# Altium schematic sheet Sensing.SchDoc
size A3; SheetNumber: 3; SheetTotal: 11
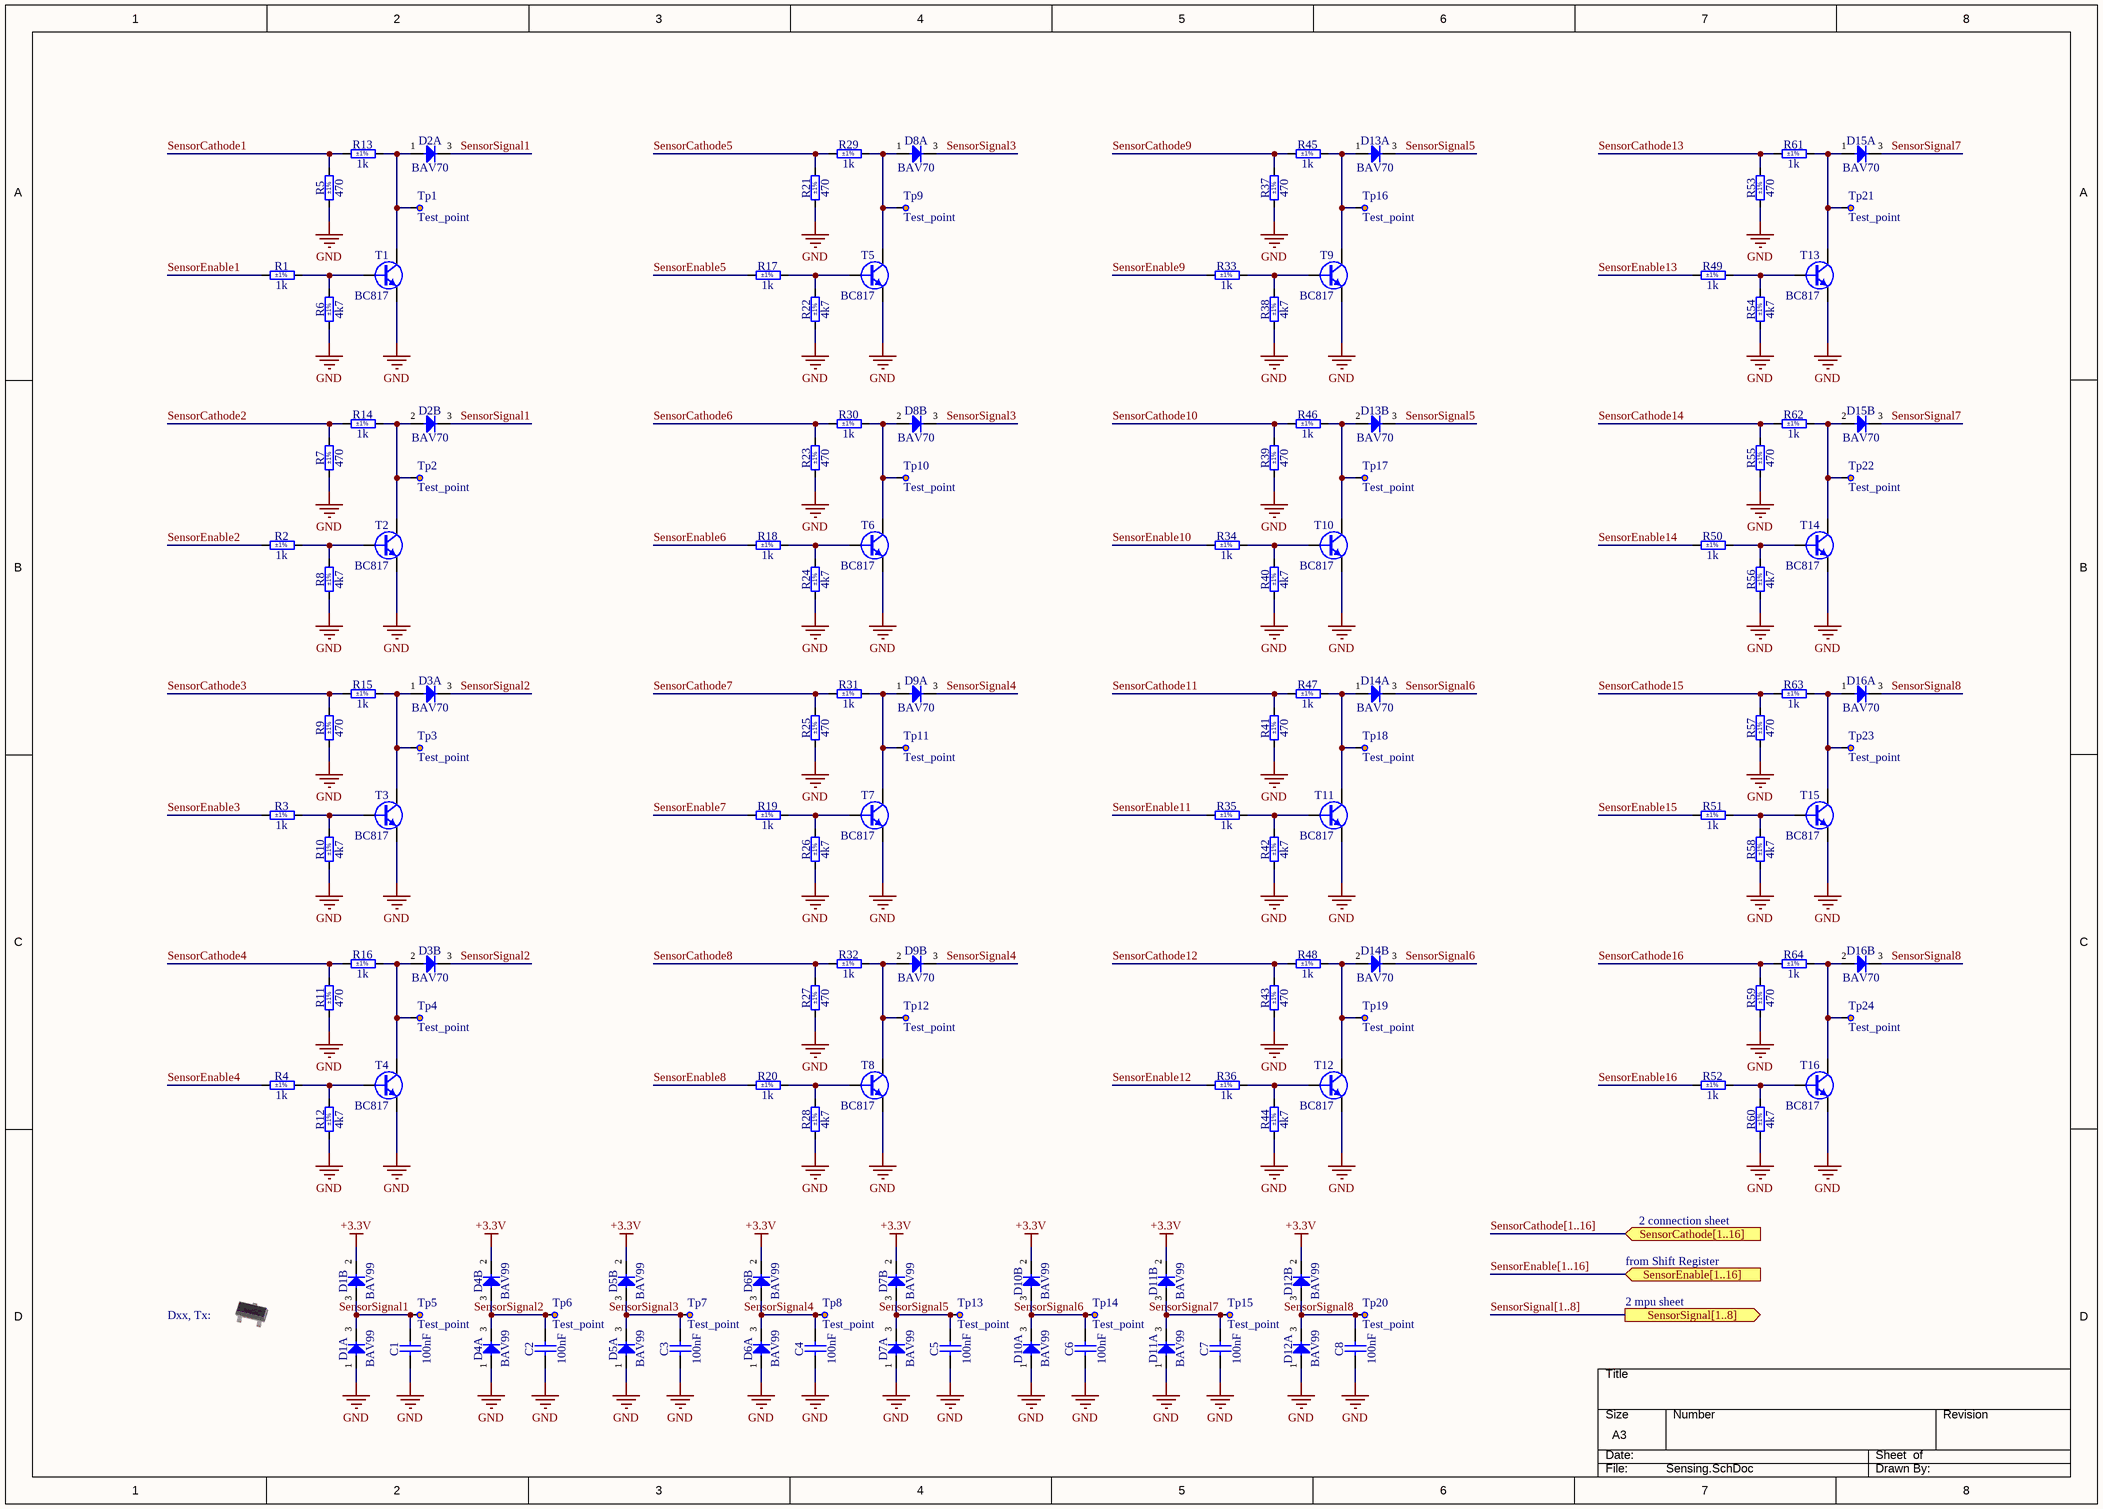
[diagram p0: Sensing.SchDoc]

## Parts
C1  100nF  [CAPC1608X87N]
C2  100nF  [CAPC1608X87N]
C3  100nF  [CAPC1608X87N]
C4  100nF  [CAPC1608X87N]
C5  100nF  [CAPC1608X87N]
C6  100nF  [CAPC1608X87N]
C7  100nF  [CAPC1608X87N]
C8  100nF  [CAPC1608X87N]
D1  BAV99  [SOT95P240X110-3N]  (parts A,B of 2)
D2  BAV70  [SOT95P240X110-3N]  (parts A,B of 2)
D3  BAV70  [SOT95P240X110-3N]  (parts A,B of 2)
D4  BAV99  [SOT95P240X110-3N]  (parts A,B of 2)
D5  BAV99  [SOT95P240X110-3N]  (parts A,B of 2)
D6  BAV99  [SOT95P240X110-3N]  (parts A,B of 2)
D7  BAV99  [SOT95P240X110-3N]  (parts A,B of 2)
D8  BAV70  [SOT95P240X110-3N]  (parts A,B of 2)
D9  BAV70  [SOT95P240X110-3N]  (parts A,B of 2)
D10  BAV99  [SOT95P240X110-3N]  (parts A,B of 2)
D11  BAV99  [SOT95P240X110-3N]  (parts A,B of 2)
D12  BAV99  [SOT95P240X110-3N]  (parts A,B of 2)
D13  BAV70  [SOT95P240X110-3N]  (parts A,B of 2)
D14  BAV70  [SOT95P240X110-3N]  (parts A,B of 2)
D15  BAV70  [SOT95P240X110-3N]  (parts A,B of 2)
D16  BAV70  [SOT95P240X110-3N]  (parts A,B of 2)
R1  1k  Tolerance: ±1%  [RESC1608X55N]
R2  1k  Tolerance: ±1%  [RESC1608X55N]
R3  1k  Tolerance: ±1%  [RESC1608X55N]
R4  1k  Tolerance: ±1%  [RESC1608X55N]
R5  470  Tolerance: ±1%  [RESC6331X70N]
R6  4k7  Tolerance: ±1%  [RESC1608X55N]
R7  470  Tolerance: ±1%  [RESC6331X70N]
R8  4k7  Tolerance: ±1%  [RESC1608X55N]
R9  470  Tolerance: ±1%  [RESC6331X70N]
R10  4k7  Tolerance: ±1%  [RESC1608X55N]
R11  470  Tolerance: ±1%  [RESC6331X70N]
R12  4k7  Tolerance: ±1%  [RESC1608X55N]
R13  1k  Tolerance: ±1%  [RESC1608X55N]
R14  1k  Tolerance: ±1%  [RESC1608X55N]
R15  1k  Tolerance: ±1%  [RESC1608X55N]
R16  1k  Tolerance: ±1%  [RESC1608X55N]
R17  1k  Tolerance: ±1%  [RESC1608X55N]
R18  1k  Tolerance: ±1%  [RESC1608X55N]
R19  1k  Tolerance: ±1%  [RESC1608X55N]
R20  1k  Tolerance: ±1%  [RESC1608X55N]
R21  470  Tolerance: ±1%  [RESC6331X70N]
R22  4k7  Tolerance: ±1%  [RESC1608X55N]
R23  470  Tolerance: ±1%  [RESC6331X70N]
R24  4k7  Tolerance: ±1%  [RESC1608X55N]
R25  470  Tolerance: ±1%  [RESC6331X70N]
R26  4k7  Tolerance: ±1%  [RESC1608X55N]
R27  470  Tolerance: ±1%  [RESC6331X70N]
R28  4k7  Tolerance: ±1%  [RESC1608X55N]
R29  1k  Tolerance: ±1%  [RESC1608X55N]
R30  1k  Tolerance: ±1%  [RESC1608X55N]
R31  1k  Tolerance: ±1%  [RESC1608X55N]
R32  1k  Tolerance: ±1%  [RESC1608X55N]
R33  1k  Tolerance: ±1%  [RESC1608X55N]
R34  1k  Tolerance: ±1%  [RESC1608X55N]
R35  1k  Tolerance: ±1%  [RESC1608X55N]
R36  1k  Tolerance: ±1%  [RESC1608X55N]
R37  470  Tolerance: ±1%  [RESC6331X70N]
R38  4k7  Tolerance: ±1%  [RESC1608X55N]
R39  470  Tolerance: ±1%  [RESC6331X70N]
R40  4k7  Tolerance: ±1%  [RESC1608X55N]
R41  470  Tolerance: ±1%  [RESC6331X70N]
R42  4k7  Tolerance: ±1%  [RESC1608X55N]
R43  470  Tolerance: ±1%  [RESC6331X70N]
R44  4k7  Tolerance: ±1%  [RESC1608X55N]
R45  1k  Tolerance: ±1%  [RESC1608X55N]
R46  1k  Tolerance: ±1%  [RESC1608X55N]
R47  1k  Tolerance: ±1%  [RESC1608X55N]
R48  1k  Tolerance: ±1%  [RESC1608X55N]
R49  1k  Tolerance: ±1%  [RESC1608X55N]
R50  1k  Tolerance: ±1%  [RESC1608X55N]
R51  1k  Tolerance: ±1%  [RESC1608X55N]
R52  1k  Tolerance: ±1%  [RESC1608X55N]
R53  470  Tolerance: ±1%  [RESC6331X70N]
R54  4k7  Tolerance: ±1%  [RESC1608X55N]
R55  470  Tolerance: ±1%  [RESC6331X70N]
R56  4k7  Tolerance: ±1%  [RESC1608X55N]
R57  470  Tolerance: ±1%  [RESC6331X70N]
R58  4k7  Tolerance: ±1%  [RESC1608X55N]
R59  470  Tolerance: ±1%  [RESC6331X70N]
R60  4k7  Tolerance: ±1%  [RESC1608X55N]
R61  1k  Tolerance: ±1%  [RESC1608X55N]
R62  1k  Tolerance: ±1%  [RESC1608X55N]
R63  1k  Tolerance: ±1%  [RESC1608X55N]
R64  1k  Tolerance: ±1%  [RESC1608X55N]
T1  BC817  [SOT95P230X110-3N]
T2  BC817  [SOT95P230X110-3N]
T3  BC817  [SOT95P230X110-3N]
T4  BC817  [SOT95P230X110-3N]
T5  BC817  [SOT95P230X110-3N]
T6  BC817  [SOT95P230X110-3N]
T7  BC817  [SOT95P230X110-3N]
T8  BC817  [SOT95P230X110-3N]
T9  BC817  [SOT95P230X110-3N]
T10  BC817  [SOT95P230X110-3N]
T11  BC817  [SOT95P230X110-3N]
T12  BC817  [SOT95P230X110-3N]
T13  BC817  [SOT95P230X110-3N]
T14  BC817  [SOT95P230X110-3N]
T15  BC817  [SOT95P230X110-3N]
T16  BC817  [SOT95P230X110-3N]
Tp1  Test_point  [TP_C40]
Tp2  Test_point  [TP_C40]
Tp3  Test_point  [TP_C40]
Tp4  Test_point  [TP_C40]
Tp5  Test_point  [TP_C40]
Tp6  Test_point  [TP_C40]
Tp7  Test_point  [TP_C40]
Tp8  Test_point  [TP_C40]
Tp9  Test_point  [TP_C40]
Tp10  Test_point  [TP_C40]
Tp11  Test_point  [TP_C40]
Tp12  Test_point  [TP_C40]
Tp13  Test_point  [TP_C40]
Tp14  Test_point  [TP_C40]
Tp15  Test_point  [TP_C40]
Tp16  Test_point  [TP_C40]
Tp17  Test_point  [TP_C40]
Tp18  Test_point  [TP_C40]
Tp19  Test_point  [TP_C40]
Tp20  Test_point  [TP_C40]
Tp21  Test_point  [TP_C40]
Tp22  Test_point  [TP_C40]
Tp23  Test_point  [TP_C40]
Tp24  Test_point  [TP_C40]

## Ports
SensorCathode[1..16] (in), SensorEnable[1..16] (in), SensorSignal[1..8] (out)

## Nets
+3.3V: D1.2(C) D4.2(C) D5.2(C) D6.2(C) D7.2(C) D10.2(C) D11.2(C) D12.2(C)
GND: C1.1 C2.1 C3.1 C4.1 C5.1 C6.1 C7.1 C8.1 D1.1(A) D4.1(A) D5.1(A) D6.1(A) D7.1(A) D10.1(A) D11.1(A) D12.1(A) R5.1 R6.1 R7.1 R8.1 R9.1 R10.1 R11.1 R12.1 R21.1 R22.1 R23.1 R24.1 R25.1 R26.1 R27.1 R28.1 R37.1 R38.1 R39.1 R40.1 R41.1 R42.1 R43.1 R44.1 R53.1 R54.1 R55.1 R56.1 R57.1 R58.1 R59.1 R60.1 T1.2(E) T2.2(E) T3.2(E) T4.2(E) T5.2(E) T6.2(E) T7.2(E) T8.2(E) T9.2(E) T10.2(E) T11.2(E) T12.2(E) T13.2(E) T14.2(E) T15.2(E) T16.2(E)
SensorCathode1: R5.2 R13.1
SensorCathode2: R7.2 R14.1
SensorCathode3: R9.2 R15.1
SensorCathode4: R11.2 R16.1
SensorCathode5: R21.2 R29.1
SensorCathode6: R23.2 R30.1
SensorCathode7: R25.2 R31.1
SensorCathode8: R27.2 R32.1
SensorCathode9: R37.2 R45.1
SensorCathode10: R39.2 R46.1
SensorCathode11: R41.2 R47.1
SensorCathode12: R43.2 R48.1
SensorCathode13: R53.2 R61.1
SensorCathode14: R55.2 R62.1
SensorCathode15: R57.2 R63.1
SensorCathode16: R59.2 R64.1
SensorEnable1: R1.1
SensorEnable2: R2.1
SensorEnable3: R3.1
SensorEnable4: R4.1
SensorEnable5: R17.1
SensorEnable6: R18.1
SensorEnable7: R19.1
SensorEnable8: R20.1
SensorEnable9: R33.1
SensorEnable10: R34.1
SensorEnable11: R35.1
SensorEnable12: R36.1
SensorEnable13: R49.1
SensorEnable14: R50.1
SensorEnable15: R51.1
SensorEnable16: R52.1
SensorSignal1: C1.2 D1.3(COMAC) D2.3(COMC) Tp5.1
SensorSignal2: C2.2 D3.3(COMC) D4.3(COMAC) Tp6.1
SensorSignal3: C3.2 D5.3(COMAC) D8.3(COMC) Tp7.1
SensorSignal4: C4.2 D6.3(COMAC) D9.3(COMC) Tp8.1
SensorSignal5: C5.2 D7.3(COMAC) D13.3(COMC) Tp13.1
SensorSignal6: C6.2 D10.3(COMAC) D14.3(COMC) Tp14.1
SensorSignal7: C7.2 D11.3(COMAC) D15.3(COMC) Tp15.1
SensorSignal8: C8.2 D12.3(COMAC) D16.3(COMC) Tp20.1
NetD2_1: D2.1(A) R13.2 T1.3(C) Tp1.1
NetD2_2: D2.2(A) R14.2 T2.3(C) Tp2.1
NetD3_1: D3.1(A) R15.2 T3.3(C) Tp3.1
NetD3_2: D3.2(A) R16.2 T4.3(C) Tp4.1
NetD8_1: D8.1(A) R29.2 T5.3(C) Tp9.1
NetD8_2: D8.2(A) R30.2 T6.3(C) Tp10.1
NetD9_1: D9.1(A) R31.2 T7.3(C) Tp11.1
NetD9_2: D9.2(A) R32.2 T8.3(C) Tp12.1
NetD13_1: D13.1(A) R45.2 T9.3(C) Tp16.1
NetD13_2: D13.2(A) R46.2 T10.3(C) Tp17.1
NetD14_1: D14.1(A) R47.2 T11.3(C) Tp18.1
NetD14_2: D14.2(A) R48.2 T12.3(C) Tp19.1
NetD15_1: D15.1(A) R61.2 T13.3(C) Tp21.1
NetD15_2: D15.2(A) R62.2 T14.3(C) Tp22.1
NetD16_1: D16.1(A) R63.2 T15.3(C) Tp23.1
NetD16_2: D16.2(A) R64.2 T16.3(C) Tp24.1
NetR1_2: R1.2 R6.2 T1.1(B)
NetR2_2: R2.2 R8.2 T2.1(B)
NetR3_2: R3.2 R10.2 T3.1(B)
NetR4_2: R4.2 R12.2 T4.1(B)
NetR17_2: R17.2 R22.2 T5.1(B)
NetR18_2: R18.2 R24.2 T6.1(B)
NetR19_2: R19.2 R26.2 T7.1(B)
NetR20_2: R20.2 R28.2 T8.1(B)
NetR33_2: R33.2 R38.2 T9.1(B)
NetR34_2: R34.2 R40.2 T10.1(B)
NetR35_2: R35.2 R42.2 T11.1(B)
NetR36_2: R36.2 R44.2 T12.1(B)
NetR49_2: R49.2 R54.2 T13.1(B)
NetR50_2: R50.2 R56.2 T14.1(B)
NetR51_2: R51.2 R58.2 T15.1(B)
NetR52_2: R52.2 R60.2 T16.1(B)

## Buses and harness runs
bus SensorCathode[1..16] = port SensorCathode[1..16]
bus SensorEnable[1..16] = port SensorEnable[1..16]
bus SensorSignal[1..8] = port SensorSignal[1..8]

## Notes on the sheet
- from Shift Register
- 2 connection sheet
- Dxx, Tx:
- 2 mpu sheet
- THIS DOCUMENT AND THE DATA DISCLOSED HEREIN OR
- HEREWITH IS THE PROPERTY OF ALTIUM LIMITED AND MAY
- DWG NO:
- REVISION
- REV:
- DESCRIPTION
- DATE
- APPROVED
- BE FREELY DISTRIBUTED IN WHOLE. NO RIGHTS ARE
- RESERVED OR EXPRESS OR IMPLIED WARANTEE GIVEN.
- ENG:
- APPROVALS
- PROJECT
- DSN:
- CHK:
- REFERENCE DOCUMENTS
- PROJECT REVISION:
- TITLE
- DOCUMENT REVISION:
- DESIGN ITEM:
- BOM:
- FAB DWG:
- PCB DWG:
- ASSY DWG:
- SCALE:
- A3
- SIZE
- CAGE CODE
- FILE NAME
- DWG NO.
- SHEET
- OF
- REV

## Library data of the parts
C1-C8 = CC0603_100NF_50V_10%_X7R: Non-polarised capacitor; Part Description: SMD Multilayer Chip Ceramic Capacitor; Manufacturer: GENERIC; Manufacturer1 Part Number: 223858615649; Voltage: 50V; TC: X7R; Tolerance: ±10%; Part Number: CC0603_100NF_50V_10%_X7R; Component Kind: Standard; Component Type: Standard; Pin Count: 2; Value: 100nF; Status: Preferred; Manufacturer Part Number: CC0603_100NF_50V_10%_X7R; Case: 0603; Mounted: Yes; Socket: No; SMD: Yes; Sense: No; Manufacturer1 Example: PHYCOMP; Manufacturer1 ComponentHeight: 0.87mm; HelpURL: \\cern.ch\dfs\Applications\Altium\Datasheets\CC0603_X7R_PHYCOMP.pdf; Author: CERN DEM JLC; CreateDate: 03.12.2007; LatestRevisionDate: 03.12.2007
D1 D4-D7 D10-D12 = BAV99: Serial Diode; Part Description: Dual Series Signal Diode; Manufacturer: FAIRCHILD SEMICONDUCTOR; Voltage: 70V; Power: 350mW; PressFit: No; Bonding: No; Part Number: BAV99; Component Kind: Standard; Component Type: Standard; Device: BAV99; PackageDescription: SOT, 0.95mm Pitch; 3 Pin, 1.40mm W X 3.00mm L X 1.10mm H body, IPC Medium Density; Manufacturer Part Number: BAV99; Pin Count: 3; Case: SOT23-3; Mounted: Yes; Socket: No; SMD: Yes; Sense: No; ComponentHeight: 1.1mm; HelpURL: \\cern.ch\dfs\Applications\Altium\Datasheets\BAV99.pdf; Author: CERN DEM JLC; CreateDate: 06.05.2008; LatestRevisionDate: 27.09.2012
D2 D3 D8 D9 D13-D16 = BAV70: Dual Common Cathode Diodes; Part Description: Dual Common Cathode High-Speed Switching Diodes; Manufacturer: NXP SEMICONDUCTORS; Voltage: 100V; PressFit: No; Bonding: No; Part Number: BAV70; Component Kind: Standard; Component Type: Standard; Device: BAV70; PackageDescription: SOT, 0.95mm Pitch; 3 Pin, 1.40mm W X 3.00mm L X 1.10mm H body, IPC Medium Density; Manufacturer Part Number: BAV70; Pin Count: 3; Case: SOT23-3; Mounted: Yes; Socket: No; SMD: Yes; Sense: No; ComponentHeight: 1.1mm; HelpURL: \\cern.ch\dfs\Applications\Altium\Datasheets\BAV70.pdf; Author: CERN DEM JLC; CreateDate: 05.06.2008; LatestRevisionDate: 05.06.2008
R1-R4 R13-R20 R29-R36 R45-R52 R61-R64 = R0603_1K_1%_0.1W_100PPM: Resistor - 1%; Part Description: General Purpose Thick Film Chip Resistor; Manufacturer: GENERIC; Manufacturer1 Part Number: NRC06F1001TRF; Power: 0.1W; TC: ±100ppm/°C; PressFit: No; Part Number: R0603_1K_1%_0.1W_100PPM; Component Kind: Standard; Component Type: Standard; Pin Count: 2; Value: 1k; Status: Preferred; Manufacturer Part Number: R0603_1K_1%_0.1W_100PPM; Case: 0603; Mounted: Yes; Sense: No; Socket: No; SMD: Yes; Manufacturer1 Example: NIC COMPONENT; Manufacturer1 ComponentHeight: 0.55mm; HelpURL: \\cern.ch\dfs\Applications\Altium\Datasheets\R0603_NIC_NRC.pdf; Author: CERN DEM JLC; CreateDate: 03.12.2007; LatestRevisionDate: 13.03.2008
R5 R7 R9 R11 R21 R23 R25 R27 R37 R39 R41 R43 R53 R55 R57 R59 = R2512_470R_1%_1W_100PPM: Resistor - 1%; Part Description: Thick Film Chip Resistor; Manufacturer: GENERIC; Manufacturer1 Part Number: RC2512FK-07470RL; Power: 1W; TC: ±100ppm/°C; PressFit: No; Part Number: R2512_470R_1%_1W_100PPM; Component Kind: Standard; Component Type: Standard; Pin Count: 2; Value: 470; Status: Preferred; Manufacturer Part Number: R2512_470R_1%_1W_100PPM; Case: 2512; Mounted: Yes; Sense: No; Socket: No; SMD: Yes; Manufacturer1 Example: YAGEO PHYCOMP; Manufacturer1 ComponentHeight: 0.65mm; HelpURL: \\cern.ch\dfs\Applications\Altium\Datasheets\R2512_YAGEO_RC_L.pdf; Author: CERN DEM BC; CreateDate: 08.03.2021; LatestRevisionDate: 08.03.2021
R6 R8 R10 R12 R22 R24 R26 R28 R38 R40 R42 R44 R54 R56 R58 R60 = R0603_4K7_1%_0.1W_100PPM: Resistor - 1%; Part Description: General Purpose Thick Film Chip Resistor; Manufacturer: GENERIC; Manufacturer1 Part Number: NRC06F4701TRF; Power: 0.1W; TC: ±100ppm/°C; PressFit: No; Part Number: R0603_4K7_1%_0.1W_100PPM; Component Kind: Standard; Component Type: Standard; Pin Count: 2; Value: 4k7; Status: Preferred; Manufacturer Part Number: R0603_4K7_1%_0.1W_100PPM; Case: 0603; Mounted: Yes; Sense: No; Socket: No; SMD: Yes; Manufacturer1 Example: NIC COMPONENT; Manufacturer1 ComponentHeight: 0.55mm; HelpURL: \\cern.ch\dfs\Applications\Altium\Datasheets\R0603_NIC_NRC.pdf; Author: CERN DEM JLC; CreateDate: 03.12.2007; LatestRevisionDate: 13.03.2008
T1-T16 = BC817: NPN Transistor; Part Description: 45V 500mA NPN General-Purpose Transistor; Manufacturer: NXP SEMICONDUCTORS; PressFit: No; Bonding: No; Part Number: BC817; Component Kind: Standard; Component Type: Standard; Device: BC817; PackageDescription: SOT23, 0.95mm Pitch; 3 Pin, 1.30mm W X 2.90mm L X 1.10mm H body, IPC Medium Density; Manufacturer Part Number: BC817; Pin Count: 3; Case: SOT23-3; Mounted: Yes; Socket: No; SMD: Yes; Sense: No; ComponentHeight: 1.1mm; HelpURL: \\cern.ch\dfs\Applications\Altium\Datasheets\BC817.pdf; Author: CERN DEM JLC; CreateDate: 12.05.2011; LatestRevisionDate: 12.05.2011
Tp1-Tp24 = Test point: Published: 8-Jun-2000; LatestRevisionDate: 17-Jul-2002; LatestRevisionNote: Re-released for DXP Platform.; PackageReference: AXIAL-0.3; Publisher: Altium Limited